# Altium schematic sheet iDProxRev2.SchDoc
size A3
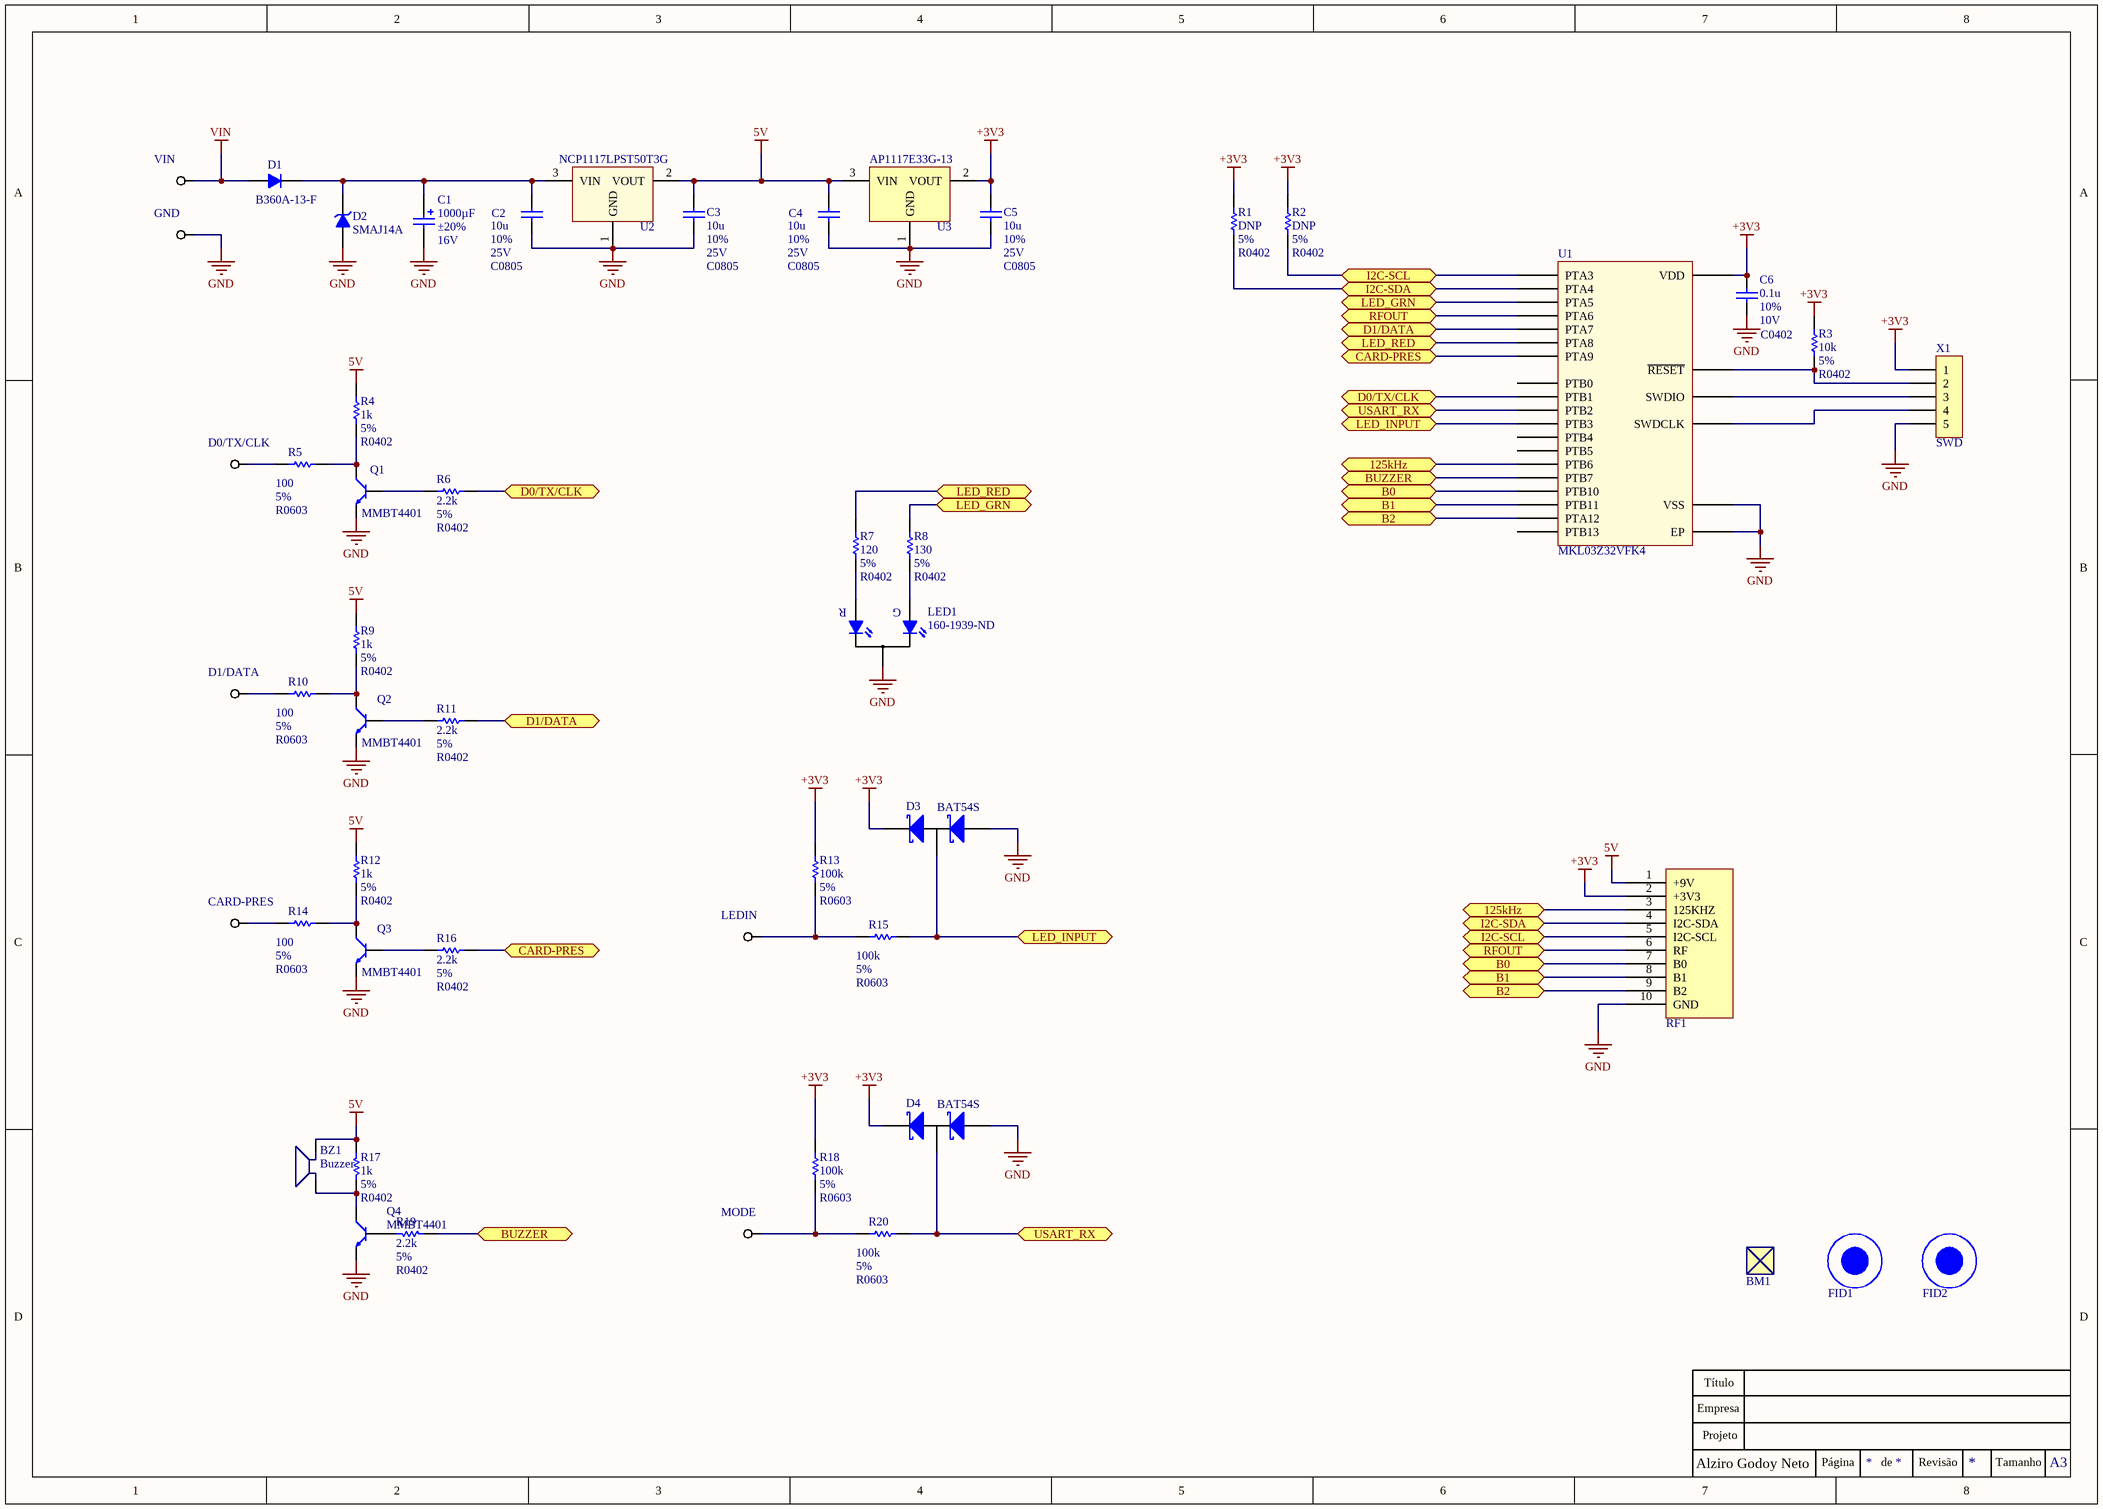
[diagram p0: iDProxRev2.SchDoc]

## Parts
BM1  BADMARK  [BADMARK]  (value not drawn)
BZ1  Buzzer  [Buzzer]
C1  Capacitance: 1000µF  Tolerance: ±20%  Voltage Rating: 16V  [ESK108M016AH2AA]  (hidden comment: ESK108M016AH2AA)
C2  value 10u  Tolerance: 10%  MAX VDC: 25V  [C0805]  (hidden comment: Cap0805)
C3  value 10u  Tolerance: 10%  MAX VDC: 25V  [C0805]  (hidden comment: Cap0805)
C4  value 10u  Tolerance: 10%  MAX VDC: 25V  [C0805]  (hidden comment: Cap0805)
C5  value 10u  Tolerance: 10%  MAX VDC: 25V  [C0805]  (hidden comment: Cap0805)
C6  value 0.1u  Tolerance: 10%  MAX VDC: 10V  [C0402]  (hidden comment: Cap0402)
CARD-PRES  Hole  [Hole]  (value not drawn)
D0/TX/CLK  Hole  [Hole]  (value not drawn)
D1  B360A-13-F  [SMA]
D1/DATA  Hole  [Hole]  (value not drawn)
D2  SMAJ14A  [SMA]
D3  BAT54S  [SOT23-3]
D4  BAT54S  [SOT23-3]
FID1  FIDUCIAL  [FIDUCIAL-1.5X3]  (value not drawn)
FID2  FIDUCIAL  [FIDUCIAL-1.5X3]  (value not drawn)
GND  Hole  [Hole]  (value not drawn)
LED1  Supplier Part Number 1: 160-1939-ND  [LTL1BEKVJNN]  (hidden comment: LTL1BEKVJNN)
LEDIN  Hole  [Hole]  (value not drawn)
MODE  Hole  [Hole]  (value not drawn)
Q1  MMBT4401  [SOT23-3]
Q2  MMBT4401  [SOT23-3]
Q3  MMBT4401  [SOT23-3]
Q4  MMBT4401  [SOT23-3]
R1  value DNP  Tolerance: 5%  [R0402]  (hidden comment: Res0402)
R2  value DNP  Tolerance: 5%  [R0402]  (hidden comment: Res0402)
R3  value 10k  Tolerance: 5%  [R0402]  (hidden comment: Res0402)
R4  value 1k  Tolerance: 5%  [R0402]  (hidden comment: Res0402)
R5  value 100  Tolerance: 5%  [R0603]  (hidden comment: Res0603)
R6  value 2.2k  Tolerance: 5%  [R0402]  (hidden comment: Res0402)
R7  value 120  Tolerance: 5%  [R0402]  (hidden comment: Res0402)
R8  value 130  Tolerance: 5%  [R0402]  (hidden comment: Res0402)
R9  value 1k  Tolerance: 5%  [R0402]  (hidden comment: Res0402)
R10  value 100  Tolerance: 5%  [R0603]  (hidden comment: Res0603)
R11  value 2.2k  Tolerance: 5%  [R0402]  (hidden comment: Res0402)
R12  value 1k  Tolerance: 5%  [R0402]  (hidden comment: Res0402)
R13  value 100k  Tolerance: 5%  [R0603]  (hidden comment: Res0603)
R14  value 100  Tolerance: 5%  [R0603]  (hidden comment: Res0603)
R15  value 100k  Tolerance: 5%  [R0603]  (hidden comment: Res0603)
R16  value 2.2k  Tolerance: 5%  [R0402]  (hidden comment: Res0402)
R17  value 1k  Tolerance: 5%  [R0402]  (hidden comment: Res0402)
R18  value 100k  Tolerance: 5%  [R0603]  (hidden comment: Res0603)
R19  value 2.2k  Tolerance: 5%  [R0402]  (hidden comment: Res0402)
R20  value 100k  Tolerance: 5%  [R0603]  (hidden comment: Res0603)
RF1  REPASK/REPMIF  [REPASK/REPMIF]  (value not drawn)
U1  MKL03Z32VFK4  [QFN24]
U2  NCP1117LPST50T3G  [SOT223]
U3  AP1117E33G-13  [SOT223]
VIN  Hole  [Hole]  (value not drawn)
X1  SWD  [1X05]

## Ports
125kHz, B0, B1, B2, BUZZER, CARD-PRES, D0/TX/CLK, D1/DATA, I2C-SCL, I2C-SDA, LED_GRN, LED_INPUT, LED_RED, RFOUT, USART_RX

## Nets
5V: BZ1.1 C3.2 C4.1 R4.2 R9.2 R12.2 R17.2 RF1.1(+9V) U2.2(VOUT) U3.3(VIN)
+3V3: C5.2 C6.2 D3.3(A1) D4.3(A1) R1.2 R2.2 R3.2 R13.2 R18.2 RF1.2(+3V3) U1.3(VDD) U3.2(VOUT) X1.1
GND: C1.2 C2.2 C3.1 C4.2 C5.1 C6.1 D2.1(A) D3.2(A2) D4.2(A2) GND.1 LED1.2(K) Q1.3 Q2.3 Q3.3 Q4.3 RF1.10(GND) U1.4(VSS) U1.25(EP) U2.1(GND) U3.1(GND) X1.5
VIN: D1.1(A) VIN.1
125kHz: RF1.3(125KHZ) U1.1(PTB6) ; port 125kHz
B0: RF1.7(B0) U1.9(PTB10) ; port B0
B1: RF1.8(B1) U1.10(PTB11) ; port B1
B2: RF1.9(B2) U1.20(PTA12) ; port B2
BUZZER: R19.2 U1.2(PTB7) ; port BUZZER
CARD-PRES: R16.1 U1.16(PTA9) ; port CARD-PRES
D0/TX/CLK: R6.1 U1.13(PTB1) ; port D0/TX/CLK
D1/DATA: R11.1 U1.11(PTA7) ; port D1/DATA
I2C-SCL: R2.1 RF1.5(I2C-SCL) U1.5(PTA3) ; port I2C-SCL
I2C-SDA: R1.1 RF1.4(I2C-SDA) U1.6(PTA4) ; port I2C-SDA
LED_GRN: R8.2 U1.7(PTA5) ; port LED_GRN
LED_INPUT: D3.1(K) R15.2 U1.17(PTB3) ; port LED_INPUT
LED_RED: R7.2 U1.15(PTA8) ; port LED_RED
RFOUT: RF1.6(RF) U1.8(PTA6) ; port RFOUT
USART_RX: D4.1(K) R20.2 U1.14(PTB2) ; port USART_RX
NetBZ1_2: BZ1.2 Q4.1 R17.1
NetC1_1: C1.1 C2.1 D1.2(K) D2.2(K) U2.3(VIN)
NetCARD-PRES_1: CARD-PRES.1 R14.1
NetD0/TX/CLK_1: D0/TX/CLK.1 R5.1
NetD1/DATA_1: D1/DATA.1 R10.1
NetLED1_1: LED1.1(AR) R7.1
NetLED1_3: LED1.3(AG) R8.1
NetLEDIN_1: LEDIN.1 R13.1 R15.1
NetMODE_1: MODE.1 R18.1 R20.1
NetQ1_1: Q1.1 R4.1 R5.2
NetQ1_2: Q1.2 R6.2
NetQ2_1: Q2.1 R9.1 R10.2
NetQ2_2: Q2.2 R11.2
NetQ3_1: Q3.1 R12.1 R14.2
NetQ3_2: Q3.2 R16.2
NetQ4_2: Q4.2 R19.1
NetR3_1: R3.1 U1.23(~{RESET}) X1.2
NetU1_22: U1.22(SWDCLK) X1.4
NetU1_24: U1.24(SWDIO) X1.3

Not connected (* = marked no-connect by the designer): U1 12(PTB0) 18(PTB4) 19(PTB5) 21(PTB13)

## Notes on the sheet
- Título
- Empresa
- Projeto
- Alziro Godoy Neto
- Página
- de
- Revisão
- Tamanho
- A3
- (in symbol LTL1BEKVJNN) R; G

## Library data of the parts
BM1 = BADMARK: Bad Mark Indicator
BZ1 = Buzzer: Standard PTH Buzzer
C1 = ESK108M016AH2AA: CAP ALUM 1000UF 20% 16V RADIAL; Manufacturer: Kemet; Lifetime @ Temp.: 2000 Hrs @ 85°C; Polarization: Polar; Ripple Current: 630mA @ 120Hz; Supplier 1: Digi-Key; Manufacturer Part Number: ESK108M016AH2AA; RoHS: RoHS Compliant; Category: Capacitors; Stock 1: 2866; Pricing 1: 1=0.43, 10=0.298, 50=0.2086, 100=0.1788, 250=0.149, 500=0.1341, 1000=0.11324, 2500=0.10728, 5000=0.10132 (USD); Packaging: Bulk; ESR (Equivalent Series Resistance): -; Operating Temperature: -40°C ~ 85°C; Applications: General Purpose; Impedance: -; Lead Spacing: 0.197" (5.00mm); Size / Dimension: 0.394" Dia (10.00mm); Height - Seated (Max): 0.669" (17.00mm); Surface Mount Land Size: -; Mounting Type: Through Hole; Package / Case: Radial, Can; ComponentLink1URL: http://capacitoredge.kemet.com/capedge2/DataSheet?pn=ESK108M016AH2AA; ComponentLink1Description: http://capacitoredge.kemet.com/capedge2/DataSheet?pn=ESK108M016AH2AA; Supplier Part Number 1: 399-6106-ND
C2-C5 = Cap0805: Capacitor
C6 = Cap0402: Capacitor
D1 = B360A: B360A Diode; Manufacturer: Diodes Incorporated; Diode Type: Schottky; Voltage - DC Reverse (Vr) (Max): 60V; Current - Average Rectified (Io): 3A; Voltage - Forward (Vf) (Max) @ If: 700mV @ 3A; Speed: Fast Recovery =< 500ns, > 200mA (Io); Current - Reverse Leakage @ Vr: 500µA @ 60V; Capacitance @ Vr, F: 200pF @ 4V, 1MHz; Supplier 1: Digi-Key; Supplier Part Number 1: B360A-FDICT-ND; Manufacturer Part Number: B360A-13-F; RoHS: RoHS Compliant; Category: Discrete Semiconductor Products; Stock 1: 132804; Pricing 1: 1=0.5, 10=0.394, 25=0.3324, 100=0.2708, 250=0.22424, 500=0.18526, 1000=0.13875, 2500=0.1275 (USD); Packaging: Cut Tape (CT); Reverse Recovery Time (trr): -; Mounting Type: Surface Mount; Package / Case: DO-214AC, SMA; Supplier Device Package: SMA; Operating Temperature - Junction: -55°C ~ 150°C; ComponentLink1URL: http://www.diodes.com/_files/datasheets/ds30891.pdf; ComponentLink1Description: http://www.diodes.com/_files/datasheets/ds30891.pdf
D2 = SMAJ14A: TVS DIODE 14VWM 23.2VC SMA; Manufacturer: Littelfuse Inc.; Type: Zener; Unidirectional Channels: 1; Voltage - Reverse Standoff (Typ): 14V; Voltage - Breakdown (Min): 15.6V; Voltage - Clamping (Max) @ Ipp: 23.2V; Current - Peak Pulse (10/1000µs): 17.2A; Power - Peak Pulse: 400W; Power Line Protection: No; Supplier 1: Digi-Key; Manufacturer Part Number: SMAJ14A; RoHS: RoHS Compliant; Category: Circuit Protection; Stock 1: 42648; Pricing 1: 1=0.43, 10=0.36, 25=0.3156, 100=0.2701, 250=0.23424, 500=0.1984, 1000=0.15295, 2500=0.13984 (USD); Packaging: Cut Tape (CT); Bidirectional Channels: -; Applications: General Purpose; Capacitance @ Frequency: -; Operating Temperature: -55°C ~ 150°C (TJ); Mounting Type: Surface Mount; Package / Case: DO-214AC, SMA; Supplier Device Package: DO-214AC (SMA); ComponentLink1URL: http://www.littelfuse.com/~/media/electronics/datasheets/tvs_diodes/littelfuse_tvs_diode_smaj_datasheet.pdf.pdf; ComponentLink1Description: http://www.littelfuse.com/~/media/electronics/datasheets/tvs_diodes/littelfuse_tvs_diode_smaj_datasheet.pdf.pdf; Supplier Part Number 1: SMAJ14ALFCT-ND
D3 D4 = BAT54S: DIODE ARRAY SCHOTTKY 30V SOT23
FID1 FID2 = FIDUCIAL: Standard fiducial for Control iD boards
LED1 = LTL1BEKVJNN: LED GRN/RED DIFF 3MM ROUND T/H; Manufacturer: Lite-On Inc.; Color: Green, Red; Lens Color: White; Lens Transparency: Diffused; Millicandela Rating: 110mcd Green, 110mcd Red; Lens Style/Size: Round with Domed Top, 3.00mm; Voltage - Forward (Vf) (Typ): 2.1V Green, 2V Red; Current - Test: 20mA Green, 20mA Red; Viewing Angle: 45°; Wavelength - Dominant: 572nm Green, 631nm Red; Wavelength - Peak: 575nm Green, 639nm Red; Supplier 1: Digi-Key; Manufacturer Part Number: LTL1BEKVJNN; RoHS: RoHS Compliant; Category: Optoelectronics; Stock 1: 19364; Pricing 1: 1=0.47, 10=0.332, 100=0.2216, 250=0.18004, 500=0.13296, 1000=0.1108, 2500=0.09972, 5000=0.09418, 10000=0.08587 (USD); Packaging: Bulk; Mounting Type: Through Hole; Features: -; Package / Case: Radial - 3 Leads; Supplier Device Package: -; Size / Dimension: -; Height (Max): 5.15mm; ComponentLink1URL: http://optoelectronics.liteon.com/upload/download/DS20-2001-645/S_110_LTL1BEKVJNN.pdf; ComponentLink1Description: http://optoelectronics.liteon.com/upload/download/DS20-2001-645/S_110_LTL1BEKVJNN.pdf
Q1-Q4 = MMBT4401LT3G: TRANS NPN 40V 0.6A SOT-23; Manufacturer: ON Semiconductor; Current - Collector (Ic) (Max): 600mA; Vce Saturation (Max) @ Ib, Ic: 750mV @ 50mA, 500mA; DC Current Gain (hFE) (Min) @ Ic, Vce: 100 @ 150mA, 1V; Power - Max: 300mW; Frequency - Transition: 250MHz; Supplier 1: Digi-Key; Manufacturer Part Number: MMBT4401LT3G; RoHS: RoHS Compliant; Category: Discrete Semiconductor Products; Stock 1: 30383; Pricing 1: 1=0.11, 10=0.097, 100=0.0531, 500=0.03262, 1000=0.02225 (USD); Packaging: Cut Tape (CT); Transistor Type: NPN; Voltage - Collector Emitter Breakdown (Max): 40V; Current - Collector Cutoff (Max): -; Mounting Type: Surface Mount; Package / Case: TO-236-3, SC-59, SOT-23-3; Supplier Device Package: SOT-23-3 (TO-236); ComponentLink1URL: http://www.onsemi.com/pub_link/Collateral/MMBT4401LT1-D.PDF; ComponentLink1Description: http://www.onsemi.com/pub_link/Collateral/MMBT4401LT1-D.PDF; Supplier Part Number 1: MMBT4401LT3GOSCT-ND
R1-R4 R6-R9 R11 R12 R16 R17 R19 = Res0402: Resistor
R5 R10 R13-R15 R18 R20 = Res0603: Resistor
RF1 = REPASK/REPMIF: Control iD RF Module
U1 = MKL03Z32VFK4: IC MCU 32BIT 32KB FLASH 24QFN
U2 = NCP1117LPST50T3G: IC REG LDO 5V 1A SOT223; Manufacturer: ON Semiconductor; Regulator Topology: Positive Fixed; Voltage - Dropout (Typical): 1.3V @ 1A; Number of Regulators: 1; Voltage - Input: Up to 18V; Current - Limit (Min): 1.1A; Supplier 1: Digi-Key; Manufacturer Part Number: NCP1117LPST50T3G; RoHS: RoHS Compliant; Category: Integrated Circuits (ICs); Stock 1: 6004; Pricing 1: 1=0.45, 10=0.362, 100=0.2468, 500=0.18476, 1000=0.13838 (USD); Packaging: Cut Tape (CT); Voltage - Output: 5V; Current - Output: 1A; Operating Temperature: 0°C ~ 125°C; Mounting Type: Surface Mount; Package / Case: TO-261-4, TO-261AA; Supplier Device Package: SOT-223; ComponentLink1URL: http://www.onsemi.com/pub_link/Collateral/NCP1117LP-D.PDF; ComponentLink1Description: http://www.onsemi.com/pub_link/Collateral/NCP1117LP-D.PDF; Supplier Part Number 1: NCP1117LPST50T3GOSCT-ND
X1 = Header 5: Header, 5-Pin, Single row, 0.1"